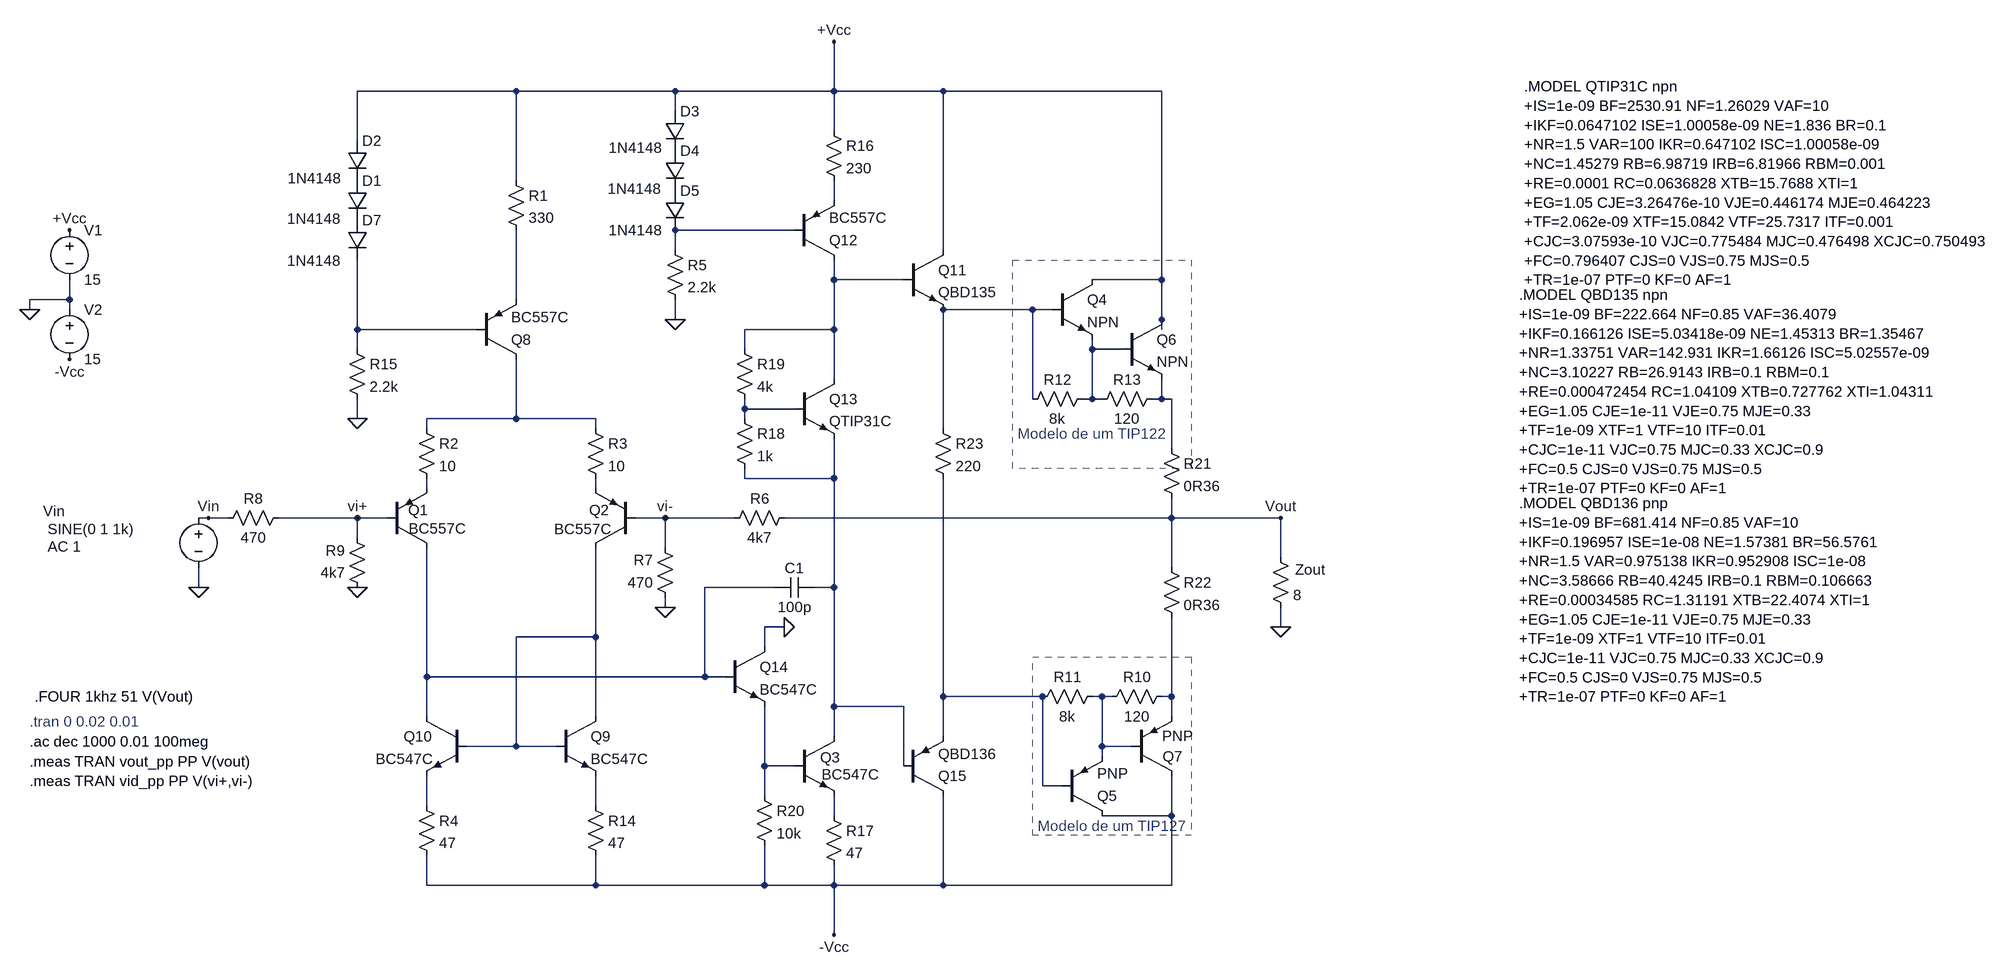
[diagram p0: schematic Amp_v3.asc]
Amp_v3.asc, the LTspice schematic file:
Version 4.1
SHEET 1 2572 1472
WIRE 112 -528 -144 -528
WIRE 368 -528 112 -528
WIRE 624 -528 624 -608
WIRE 624 -528 368 -528
WIRE 800 -528 624 -528
WIRE 1152 -528 800 -528
WIRE 368 -496 368 -528
WIRE 624 -464 624 -528
WIRE -144 -448 -144 -528
WIRE 112 -384 112 -528
WIRE 624 -352 624 -384
WIRE 560 -304 368 -304
WIRE 368 -272 368 -304
WIRE 800 -272 800 -528
WIRE 624 -224 624 -256
WIRE 736 -224 624 -224
WIRE 1152 -224 1152 -528
WIRE 1152 -224 1040 -224
WIRE -608 -192 -608 -224
WIRE -608 -192 -672 -192
WIRE 112 -192 112 -304
WIRE -672 -176 -672 -192
WIRE -608 -176 -608 -192
WIRE 944 -176 800 -176
WIRE 976 -176 944 -176
WIRE 368 -160 368 -192
WIRE 1152 -160 1152 -224
WIRE -144 -144 -144 -256
WIRE 48 -144 -144 -144
WIRE 624 -144 624 -224
WIRE 624 -144 480 -144
WIRE 1152 -144 1152 -160
WIRE -144 -112 -144 -144
WIRE 480 -112 480 -144
WIRE 1040 -112 1040 -128
WIRE 1088 -112 1040 -112
WIRE 624 -64 624 -144
WIRE 944 -32 944 -176
WIRE 1040 -32 1040 -112
WIRE 1040 -32 1024 -32
WIRE 1056 -32 1040 -32
WIRE 1152 -32 1152 -64
WIRE 1152 -32 1136 -32
WIRE 1168 -32 1152 -32
WIRE 480 -16 480 -32
WIRE 560 -16 480 -16
WIRE -144 0 -144 -32
WIRE 112 0 112 -96
WIRE 112 0 -32 0
WIRE 240 0 112 0
WIRE 480 0 480 -16
WIRE -32 16 -32 0
WIRE 240 16 240 0
WIRE 800 16 800 -176
WIRE 1168 48 1168 -32
WIRE 480 96 480 80
WIRE 624 96 624 32
WIRE 624 96 480 96
WIRE -32 112 -32 96
WIRE 240 112 240 96
WIRE -384 160 -400 160
WIRE -352 160 -384 160
WIRE -144 160 -272 160
WIRE -96 160 -144 160
WIRE 352 160 304 160
WIRE 464 160 352 160
WIRE 1168 160 1168 128
WIRE 1168 160 544 160
WIRE 1344 160 1168 160
WIRE -144 192 -144 160
WIRE 352 208 352 160
WIRE 1344 224 1344 160
WIRE 1168 240 1168 160
WIRE -400 272 -400 240
WIRE 528 272 416 272
WIRE 624 272 624 96
WIRE 624 272 592 272
WIRE 352 304 352 288
WIRE 544 336 512 336
WIRE 1344 336 1344 304
WIRE 240 352 240 208
WIRE 240 352 112 352
WIRE 512 368 512 336
WIRE -32 416 -32 208
WIRE 416 416 416 272
WIRE 416 416 -32 416
WIRE 448 416 416 416
WIRE 800 448 800 96
WIRE 960 448 800 448
WIRE 1056 448 1040 448
WIRE 1072 448 1056 448
WIRE 1168 448 1168 320
WIRE 1168 448 1152 448
WIRE 624 464 624 272
WIRE 736 464 624 464
WIRE -32 480 -32 416
WIRE 240 480 240 352
WIRE 1168 480 1168 448
WIRE 624 512 624 464
WIRE 800 512 800 448
WIRE 112 528 112 352
WIRE 112 528 32 528
WIRE 176 528 112 528
WIRE 1056 528 1056 448
WIRE 1104 528 1056 528
WIRE 1056 544 1056 528
WIRE 512 560 512 464
WIRE 560 560 512 560
WIRE 736 560 736 464
WIRE 960 592 960 448
WIRE 992 592 960 592
WIRE 512 608 512 560
WIRE -32 624 -32 576
WIRE 240 624 240 576
WIRE 624 640 624 608
WIRE 1168 640 1168 576
WIRE 1168 640 1056 640
WIRE -32 752 -32 704
WIRE 240 752 240 704
WIRE 240 752 -32 752
WIRE 512 752 512 688
WIRE 512 752 240 752
WIRE 624 752 624 720
WIRE 624 752 512 752
WIRE 800 752 800 608
WIRE 800 752 624 752
WIRE 1168 752 1168 640
WIRE 1168 752 800 752
WIRE 624 832 624 752
FLAG -400 272 0
FLAG -672 -176 0
FLAG -608 -304 +Vcc
FLAG 624 -608 +Vcc
FLAG -608 -96 -Vcc
FLAG 624 832 -Vcc
FLAG -144 272 0
FLAG 352 304 0
FLAG 1344 160 Vout
FLAG 1344 336 0
FLAG -144 0 0
FLAG 368 -160 0
FLAG 544 336 0
FLAG -144 160 vi+
FLAG 352 160 vi-
FLAG -384 160 Vin
SYMBOL voltage -608 -320 R0
WINDOW 123 24 44 Left 2
WINDOW 39 0 0 Left 0
SYMATTR InstName V1
SYMATTR Value 15
SYMBOL voltage -608 -192 R0
WINDOW 123 0 0 Left 0
WINDOW 39 0 0 Left 0
SYMATTR InstName V2
SYMATTR Value 15
SYMBOL voltage -400 144 R0
WINDOW 123 -243 62 Left 2
WINDOW 39 24 152 Left 0
WINDOW 0 -250 5 Left 2
WINDOW 3 -243 34 Left 2
SYMATTR Value2 AC 1
SYMATTR InstName Vin
SYMATTR Value SINE(0 1 1k)
SYMBOL res -48 0 R0
SYMATTR InstName R2
SYMATTR Value 10
SYMBOL res 224 0 R0
SYMATTR InstName R3
SYMATTR Value 10
SYMBOL res 560 144 R90
WINDOW 0 0 56 VBottom 2
WINDOW 3 32 56 VTop 2
SYMATTR InstName R6
SYMATTR Value 4k7
SYMBOL res 368 304 R180
WINDOW 0 36 76 Left 2
WINDOW 3 36 40 Left 2
SYMATTR InstName R7
SYMATTR Value 470
SYMBOL res 1168 432 R90
WINDOW 0 0 56 VBottom 2
WINDOW 3 32 56 VTop 2
SYMATTR InstName R10
SYMATTR Value 120
SYMBOL res 1056 432 R90
WINDOW 0 0 56 VBottom 2
WINDOW 3 32 56 VTop 2
SYMATTR InstName R11
SYMATTR Value 8k
SYMBOL res 1040 -48 R90
WINDOW 0 0 56 VBottom 2
WINDOW 3 32 56 VTop 2
SYMATTR InstName R12
SYMATTR Value 8k
SYMBOL res 1152 -48 R90
WINDOW 0 0 56 VBottom 2
WINDOW 3 32 56 VTop 2
SYMATTR InstName R13
SYMATTR Value 120
SYMBOL cap 592 256 R90
WINDOW 0 0 32 VBottom 2
WINDOW 3 32 32 VTop 2
SYMATTR InstName C1
SYMATTR Value 100p
SYMBOL npn 560 512 R0
WINDOW 0 42 34 Left 2
WINDOW 3 44 61 Left 2
SYMATTR InstName Q3
SYMATTR Value BC547C
SYMBOL npn 976 -224 R0
SYMATTR InstName Q4
SYMBOL pnp 992 640 M180
SYMATTR InstName Q5
SYMBOL npn 1088 -160 R0
SYMATTR InstName Q6
SYMBOL pnp 1104 576 M180
WINDOW 0 50 32 Left 2
WINDOW 3 49 65 Left 2
SYMATTR InstName Q7
SYMBOL pnp -96 208 M180
WINDOW 0 34 61 Left 2
WINDOW 3 35 31 Left 2
SYMATTR InstName Q1
SYMATTR Value BC557C
SYMBOL pnp 304 208 R180
WINDOW 0 42 61 Left 2
WINDOW 3 40 30 Left 2
SYMATTR InstName Q2
SYMATTR Value BC557C
SYMBOL res -256 144 R90
WINDOW 0 0 56 VBottom 2
WINDOW 3 32 56 VTop 2
SYMATTR InstName R8
SYMATTR Value 470
SYMBOL res -128 288 R180
WINDOW 0 36 76 Left 2
WINDOW 3 36 40 Left 2
SYMATTR InstName R9
SYMATTR Value 4k7
SYMBOL res 1328 208 R0
WINDOW 0 39 35 Left 2
SYMATTR InstName Zout
SYMATTR Value 8
SYMBOL res -160 -128 R0
SYMATTR InstName R15
SYMATTR Value 2.2k
SYMBOL res 96 -400 R0
SYMATTR InstName R1
SYMATTR Value 330
SYMBOL pnp 48 -96 M180
SYMATTR InstName Q8
SYMATTR Value BC557C
SYMBOL diode -160 -320 R0
WINDOW 3 -97 65 Left 2
SYMATTR Value 1N4148
SYMATTR InstName D7
SYMBOL npn 176 480 R0
SYMATTR InstName Q9
SYMATTR Value BC547C
SYMBOL npn 32 480 M0
SYMATTR InstName Q10
SYMATTR Value BC547C
SYMBOL res -48 608 R0
SYMATTR InstName R4
SYMATTR Value 47
SYMBOL res 224 608 R0
SYMATTR InstName R14
SYMATTR Value 47
SYMBOL res 352 -288 R0
SYMATTR InstName R5
SYMATTR Value 2.2k
SYMBOL res 608 -480 R0
SYMATTR InstName R16
SYMATTR Value 230
SYMBOL pnp 560 -256 M180
SYMATTR InstName Q12
SYMATTR Value BC557C
SYMBOL res 608 624 R0
SYMATTR InstName R17
SYMATTR Value 47
SYMBOL npn 560 -64 R0
SYMATTR InstName Q13
SYMATTR Value QTIP31C
SYMBOL res 464 -16 R0
SYMATTR InstName R18
SYMATTR Value 1k
SYMBOL res 464 -128 R0
SYMATTR InstName R19
SYMATTR Value 4k
SYMBOL npn 448 368 R0
SYMATTR InstName Q14
SYMATTR Value BC547C
SYMBOL res 496 592 R0
SYMATTR InstName R20
SYMATTR Value 10k
SYMBOL diode -160 -384 R0
WINDOW 3 -97 61 Left 2
SYMATTR Value 1N4148
SYMATTR InstName D1
SYMBOL diode -160 -448 R0
WINDOW 3 -96 60 Left 2
SYMATTR Value 1N4148
SYMATTR InstName D2
SYMBOL diode 352 -496 R0
WINDOW 3 -91 59 Left 2
SYMATTR Value 1N4148
SYMATTR InstName D3
SYMBOL diode 352 -432 R0
WINDOW 3 -93 61 Left 2
SYMATTR Value 1N4148
SYMATTR InstName D4
SYMBOL diode 352 -368 R0
WINDOW 3 -91 64 Left 2
SYMATTR Value 1N4148
SYMATTR InstName D5
SYMBOL res 1152 32 R0
SYMATTR InstName R21
SYMATTR Value 0R36
SYMBOL res 1152 224 R0
SYMATTR InstName R22
SYMATTR Value 0R36
SYMBOL npn 736 -272 R0
SYMATTR InstName Q11
SYMATTR Value QBD135
SYMBOL pnp 736 608 M180
SYMATTR InstName Q15
SYMATTR Value QBD136
SYMBOL res 784 0 R0
SYMATTR InstName R23
SYMATTR Value 220
TEXT -672 488 Left 2 ;.tran 0 0.02 0.01
TEXT -664 448 Left 2 !.FOUR 1khz 51 V(Vout)
TEXT 920 24 Left 2 ;Modelo de um TIP122
TEXT 952 656 Left 2 ;Modelo de um TIP127
TEXT -672 520 Left 2 !.ac dec 1000 0.01 100meg
TEXT -672 552 Left 2 !.meas TRAN vout_pp PP V(vout)
TEXT -672 584 Left 2 !.meas TRAN vid_pp PP V(vi+,vi-)
TEXT 1736 -536 Left 2 !.MODEL QTIP31C npn\n+IS=1e-09 BF=2530.91 NF=1.26029 VAF=10\n+IKF=0.0647102 ISE=1.00058e-09 NE=1.836 BR=0.1\n+NR=1.5 VAR=100 IKR=0.647102 ISC=1.00058e-09\n+NC=1.45279 RB=6.98719 IRB=6.81966 RBM=0.001\n+RE=0.0001 RC=0.0636828 XTB=15.7688 XTI=1\n+EG=1.05 CJE=3.26476e-10 VJE=0.446174 MJE=0.464223\n+TF=2.062e-09 XTF=15.0842 VTF=25.7317 ITF=0.001\n+CJC=3.07593e-10 VJC=0.775484 MJC=0.476498 XCJC=0.750493\n+FC=0.796407 CJS=0 VJS=0.75 MJS=0.5\n+TR=1e-07 PTF=0 KF=0 AF=1
TEXT 1728 -200 Left 2 !.MODEL QBD135 npn\n+IS=1e-09 BF=222.664 NF=0.85 VAF=36.4079\n+IKF=0.166126 ISE=5.03418e-09 NE=1.45313 BR=1.35467\n+NR=1.33751 VAR=142.931 IKR=1.66126 ISC=5.02557e-09\n+NC=3.10227 RB=26.9143 IRB=0.1 RBM=0.1\n+RE=0.000472454 RC=1.04109 XTB=0.727762 XTI=1.04311\n+EG=1.05 CJE=1e-11 VJE=0.75 MJE=0.33\n+TF=1e-09 XTF=1 VTF=10 ITF=0.01\n+CJC=1e-11 VJC=0.75 MJC=0.33 XCJC=0.9\n+FC=0.5 CJS=0 VJS=0.75 MJS=0.5\n+TR=1e-07 PTF=0 KF=0 AF=1
TEXT 1728 136 Left 2 !.MODEL QBD136 pnp\n+IS=1e-09 BF=681.414 NF=0.85 VAF=10\n+IKF=0.196957 ISE=1e-08 NE=1.57381 BR=56.5761\n+NR=1.5 VAR=0.975138 IKR=0.952908 ISC=1e-08\n+NC=3.58666 RB=40.4245 IRB=0.1 RBM=0.106663\n+RE=0.00034585 RC=1.31191 XTB=22.4074 XTI=1\n+EG=1.05 CJE=1e-11 VJE=0.75 MJE=0.33\n+TF=1e-09 XTF=1 VTF=10 ITF=0.01\n+CJC=1e-11 VJC=0.75 MJC=0.33 XCJC=0.9\n+FC=0.5 CJS=0 VJS=0.75 MJS=0.5\n+TR=1e-07 PTF=0 KF=0 AF=1
RECTANGLE Normal 1200 80 912 -256 2
RECTANGLE Normal 1200 672 944 384 2

The netlist it stands for:
* Amp_v3.asc
V1 +Vcc 0 15
V2 0 -Vcc 15
Vin Vin 0 SINE(0 1 1k) AC 1
R2 N010 N012 10
R3 N010 N013 10
R6 Vout vi- 4k7
R7 0 vi- 470
R10 N018 N017 120
R11 N017 N016 8k
R12 N007 N005 8k
R13 N008 N007 120
C1 N011 N014 100p
Q3 N011 N019 N022 0 BC547C
Q4 +Vcc N005 N007 0 NPN
Q5 -Vcc N016 N017 0 PNP
Q6 +Vcc N007 N008 0 NPN
Q7 -Vcc N017 N018 0 PNP
Q1 N014 vi+ N012 0 BC557C
Q2 N015 vi- N013 0 BC557C
R8 vi+ Vin 470
R9 0 vi+ 4k7
R§Zout Vout 0 8
R15 N006 0 2.2k
R1 +Vcc N004 330
Q8 N010 N006 N004 0 BC557C
D7 P001 N006 1N4148
Q9 N015 N015 N021 0 BC547C
Q10 N014 N015 N020 0 BC547C
R4 N020 -Vcc 47
R14 N021 -Vcc 47
R5 N002 0 2.2k
R16 +Vcc N001 230
Q12 N003 N002 N001 0 BC557C
R17 N022 -Vcc 47
Q13 N003 N009 N011 0 QTIP31C
R18 N009 N011 1k
R19 N003 N009 4k
Q14 0 N014 N019 0 BC547C
R20 N019 -Vcc 10k
D1 P002 P001 1N4148
D2 +Vcc P002 1N4148
D3 +Vcc P003 1N4148
D4 P003 P004 1N4148
D5 P004 N002 1N4148
R21 N008 Vout 0R36
R22 Vout N018 0R36
Q11 +Vcc N003 N005 0 QBD135
Q15 -Vcc N011 N016 0 QBD136
R23 N005 N016 220
.model D D
.lib standard.dio
.model NPN NPN
.model PNP PNP
.lib standard.bjt
* .tran 0 0.02 0.01
.FOUR 1khz 51 V(Vout)
* Modelo de um TIP122
* Modelo de um TIP127
.ac dec 1000 0.01 100meg
.meas TRAN vout_pp PP V(vout)
.meas TRAN vid_pp PP V(vi+,vi-)
.MODEL QTIP31C npn
+IS=1e-09 BF=2530.91 NF=1.26029 VAF=10
+IKF=0.0647102 ISE=1.00058e-09 NE=1.836 BR=0.1
+NR=1.5 VAR=100 IKR=0.647102 ISC=1.00058e-09
+NC=1.45279 RB=6.98719 IRB=6.81966 RBM=0.001
+RE=0.0001 RC=0.0636828 XTB=15.7688 XTI=1
+EG=1.05 CJE=3.26476e-10 VJE=0.446174 MJE=0.464223
+TF=2.062e-09 XTF=15.0842 VTF=25.7317 ITF=0.001
+CJC=3.07593e-10 VJC=0.775484 MJC=0.476498 XCJC=0.750493
+FC=0.796407 CJS=0 VJS=0.75 MJS=0.5
+TR=1e-07 PTF=0 KF=0 AF=1
.MODEL QBD135 npn
+IS=1e-09 BF=222.664 NF=0.85 VAF=36.4079
+IKF=0.166126 ISE=5.03418e-09 NE=1.45313 BR=1.35467
+NR=1.33751 VAR=142.931 IKR=1.66126 ISC=5.02557e-09
+NC=3.10227 RB=26.9143 IRB=0.1 RBM=0.1
+RE=0.000472454 RC=1.04109 XTB=0.727762 XTI=1.04311
+EG=1.05 CJE=1e-11 VJE=0.75 MJE=0.33
+TF=1e-09 XTF=1 VTF=10 ITF=0.01
+CJC=1e-11 VJC=0.75 MJC=0.33 XCJC=0.9
+FC=0.5 CJS=0 VJS=0.75 MJS=0.5
+TR=1e-07 PTF=0 KF=0 AF=1
.MODEL QBD136 pnp
+IS=1e-09 BF=681.414 NF=0.85 VAF=10
+IKF=0.196957 ISE=1e-08 NE=1.57381 BR=56.5761
+NR=1.5 VAR=0.975138 IKR=0.952908 ISC=1e-08
+NC=3.58666 RB=40.4245 IRB=0.1 RBM=0.106663
+RE=0.00034585 RC=1.31191 XTB=22.4074 XTI=1
+EG=1.05 CJE=1e-11 VJE=0.75 MJE=0.33
+TF=1e-09 XTF=1 VTF=10 ITF=0.01
+CJC=1e-11 VJC=0.75 MJC=0.33 XCJC=0.9
+FC=0.5 CJS=0 VJS=0.75 MJS=0.5
+TR=1e-07 PTF=0 KF=0 AF=1
.backanno
.end